# Altium schematic sheet 01 ZYNQ_DDR.SchDoc
size A4
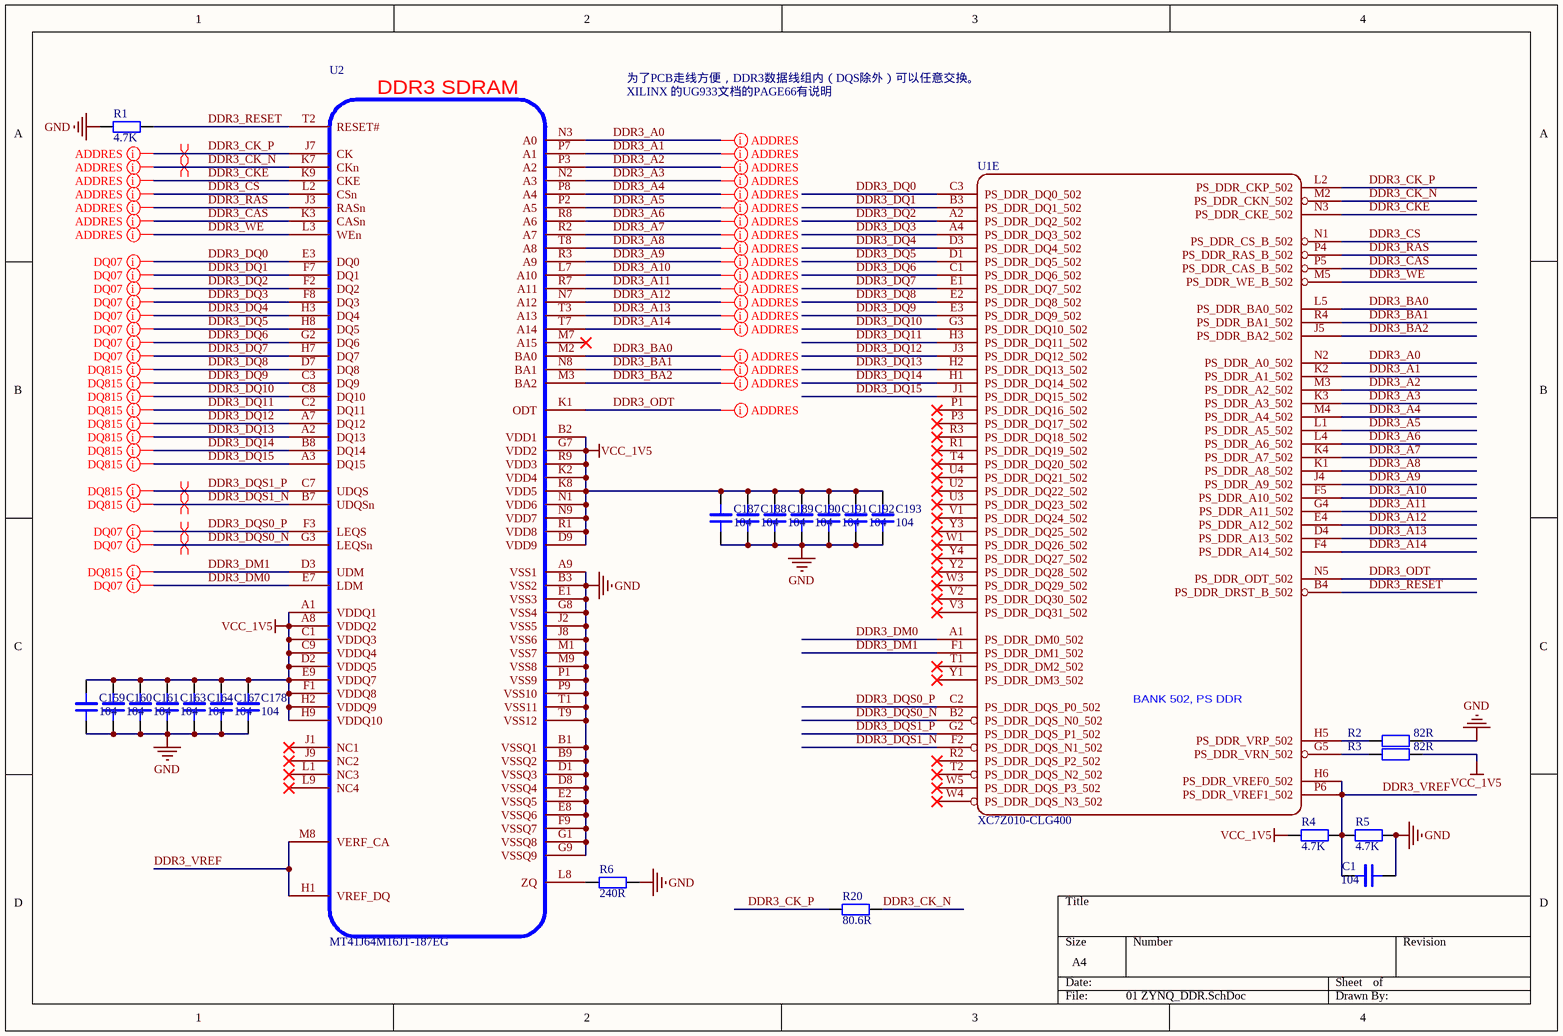
[diagram p0: 01 ZYNQ_DDR.SchDoc]

## Parts
C1  104  [LC-0402_C]
C159  104  [LC-0402_C]
C160  104  [LC-0402_C]
C161  104  [LC-0402_C]
C163  104  [LC-0402_C]
C164  104  [LC-0402_C]
C167  104  [LC-0402_C]
C178  104  [LC-0402_C]
C187  104  [LC-0402_C]
C188  104  [LC-0402_C]
C189  104  [LC-0402_C]
C190  104  [LC-0402_C]
C191  104  [LC-0402_C]
C192  104  [LC-0402_C]
C193  104  [LC-0402_C]
R1  4.7K  [LC-0402_R]
R2  82R  [LC-0402_R]
R3  82R  [LC-0402_R]
R4  4.7K  [LC-0402_R]
R5  4.7K  [LC-0402_R]
R6  240R  [LC-0402_R]
R20  80.6R  [LC-0402_R]
U1  XC7Z010-CLG400  [CLG400-0.8]  (part E of 8)
U2  MT41J64M16JT-187EG  [FBGA96]

## Nets
GND: C1.2 C159.1 C160.1 C161.1 C163.1 C164.1 C167.1 C178.1 C187.1 C188.1 C189.1 C190.1 C191.1 C192.1 C193.1 R1.2 R2.1 R5.1 R6.2 U2.A9(VSS1) U2.B1(VSSQ1) U2.B3(VSS2) U2.B9(VSSQ2) U2.D1(VSSQ3) U2.D8(VSSQ4) U2.E1(VSS3) U2.E2(VSSQ5) U2.E8(VSSQ6) U2.F9(VSSQ7) U2.G1(VSSQ8) U2.G8(VSS4) U2.G9(VSSQ9) U2.J2(VSS5) U2.J8(VSS6) U2.M1(VSS7) U2.M9(VSS8) U2.P1(VSS9) U2.P9(VSS10) U2.T1(VSS11) U2.T9(VSS12)
VCC_1V5: C159.2 C160.2 C161.2 C163.2 C164.2 C167.2 C178.2 C187.2 C188.2 C189.2 C190.2 C191.2 C192.2 C193.2 R3.1 R4.2 U2.A1(VDDQ1) U2.A8(VDDQ2) U2.B2(VDD1) U2.C1(VDDQ3) U2.C9(VDDQ4) U2.D2(VDDQ5) U2.D9(VDD9) U2.E9(VDDQ7) U2.F1(VDDQ8) U2.G7(VDD2) U2.H2(VDDQ9) U2.H9(VDDQ10) U2.K2(VDD4) U2.K8(VDD5) U2.N1(VDD6) U2.N9(VDD7) U2.R1(VDD8) U2.R9(VDD3)
DDR3_A0: U1.N2(PS_DDR_A0_502) U2.N3(A0)
DDR3_A1: U1.K2(PS_DDR_A1_502) U2.P7(A1)
DDR3_A2: U1.M3(PS_DDR_A2_502) U2.P3(A2)
DDR3_A3: U1.K3(PS_DDR_A3_502) U2.N2(A3)
DDR3_A4: U1.M4(PS_DDR_A4_502) U2.P8(A4)
DDR3_A5: U1.L1(PS_DDR_A5_502) U2.P2(A5)
DDR3_A6: U1.L4(PS_DDR_A6_502) U2.R8(A6)
DDR3_A7: U1.K4(PS_DDR_A7_502) U2.R2(A7)
DDR3_A8: U1.K1(PS_DDR_A8_502) U2.T8(A8)
DDR3_A9: U1.J4(PS_DDR_A9_502) U2.R3(A9)
DDR3_A10: U1.F5(PS_DDR_A10_502) U2.L7(A10)
DDR3_A11: U1.G4(PS_DDR_A11_502) U2.R7(A11)
DDR3_A12: U1.E4(PS_DDR_A12_502) U2.N7(A12)
DDR3_A13: U1.D4(PS_DDR_A13_502) U2.T3(A13)
DDR3_A14: U1.F4(PS_DDR_A14_502) U2.T7(A14)
DDR3_BA0: U1.L5(PS_DDR_BA0_502) U2.M2(BA0)
DDR3_BA1: U1.R4(PS_DDR_BA1_502) U2.N8(BA1)
DDR3_BA2: U1.J5(PS_DDR_BA2_502) U2.M3(BA2)
DDR3_CAS: U1.P5(PS_DDR_CAS_B_502) U2.K3(CASn)
DDR3_CK_N: R20.2 U1.M2(PS_DDR_CKN_502) U2.K7(CKn)
DDR3_CK_P: R20.1 U1.L2(PS_DDR_CKP_502) U2.J7(CK)
DDR3_CKE: U1.N3(PS_DDR_CKE_502) U2.K9(CKE)
DDR3_CS: U1.N1(PS_DDR_CS_B_502) U2.L2(CSn)
DDR3_DM0: U1.A1(PS_DDR_DM0_502) U2.E7(LDM)
DDR3_DM1: U1.F1(PS_DDR_DM1_502) U2.D3(UDM)
DDR3_DQ0: U1.C3(PS_DDR_DQ0_502) U2.E3(DQ0)
DDR3_DQ1: U1.B3(PS_DDR_DQ1_502) U2.F7(DQ1)
DDR3_DQ2: U1.A2(PS_DDR_DQ2_502) U2.F2(DQ2)
DDR3_DQ3: U1.A4(PS_DDR_DQ3_502) U2.F8(DQ3)
DDR3_DQ4: U1.D3(PS_DDR_DQ4_502) U2.H3(DQ4)
DDR3_DQ5: U1.D1(PS_DDR_DQ5_502) U2.H8(DQ5)
DDR3_DQ6: U1.C1(PS_DDR_DQ6_502) U2.G2(DQ6)
DDR3_DQ7: U1.E1(PS_DDR_DQ7_502) U2.H7(DQ7)
DDR3_DQ8: U1.E2(PS_DDR_DQ8_502) U2.D7(DQ8)
DDR3_DQ9: U1.E3(PS_DDR_DQ9_502) U2.C3(DQ9)
DDR3_DQ10: U1.G3(PS_DDR_DQ10_502) U2.C8(DQ10)
DDR3_DQ11: U1.H3(PS_DDR_DQ11_502) U2.C2(DQ11)
DDR3_DQ12: U1.J3(PS_DDR_DQ12_502) U2.A7(DQ12)
DDR3_DQ13: U1.H2(PS_DDR_DQ13_502) U2.A2(DQ13)
DDR3_DQ14: U1.H1(PS_DDR_DQ14_502) U2.B8(DQ14)
DDR3_DQ15: U1.J1(PS_DDR_DQ15_502) U2.A3(DQ15)
DDR3_DQS0_N: U1.B2(PS_DDR_DQS_N0_502) U2.G3(LEQSn)
DDR3_DQS0_P: U1.C2(PS_DDR_DQS_P0_502) U2.F3(LEQS)
DDR3_DQS1_N: U1.F2(PS_DDR_DQS_N1_502) U2.B7(UDQSn)
DDR3_DQS1_P: U1.G2(PS_DDR_DQS_P1_502) U2.C7(UDQS)
DDR3_ODT: U1.N5(PS_DDR_ODT_502) U2.K1(ODT)
DDR3_RAS: U1.P4(PS_DDR_RAS_B_502) U2.J3(RASn)
DDR3_RESET: R1.1 U1.B4(PS_DDR_DRST_B_502) U2.T2(RESET#)
DDR3_VREF: C1.1 R4.1 R5.2 U1.H6(PS_DDR_VREF0_502) U1.P6(PS_DDR_VREF1_502) U2.H1(VREF_DQ) U2.M8(VERF_CA)
DDR3_WE: U1.M5(PS_DDR_WE_B_502) U2.L3(WEn)
NetR2_2: R2.2 U1.H5(PS_DDR_VRP_502)
NetR3_2: R3.2 U1.G5(PS_DDR_VRN_502)
NetR6_1: R6.1 U2.L8(ZQ)

Not connected (* = marked no-connect by the designer): U1 P1(PS_DDR_DQ16_502)* P3(PS_DDR_DQ17_502)* R1(PS_DDR_DQ19_502)* R2(PS_DDR_DQS_P2_502)* R3(PS_DDR_DQ18_502)* T1(PS_DDR_DM2_502)* T2(PS_DDR_DQS_N2_502)* T4(PS_DDR_DQ20_502)* U2(PS_DDR_DQ22_502)* U3(PS_DDR_DQ23_502)* U4(PS_DDR_DQ21_502)* V1(PS_DDR_DQ24_502)* V2(PS_DDR_DQ30_502)* V3(PS_DDR_DQ31_502)* W1(PS_DDR_DQ26_502)* W3(PS_DDR_DQ29_502)* W4(PS_DDR_DQS_N3_502)* W5(PS_DDR_DQS_P3_502)* Y1(PS_DDR_DM3_502)* Y2(PS_DDR_DQ28_502)* Y3(PS_DDR_DQ25_502)* Y4(PS_DDR_DQ27_502)*; U2 J1(NC1)* J9(NC2)* L1(NC3)* L9(NC4)* M7(A15)*

## Layout directives
net class ADDRES: DDR3_A0, DDR3_A1, DDR3_A2, DDR3_A3, DDR3_A4, DDR3_A5, DDR3_A6, DDR3_A7, DDR3_A8, DDR3_A9, DDR3_A10, DDR3_A11, DDR3_A12, DDR3_A13, DDR3_A14, DDR3_BA0, DDR3_BA1, DDR3_BA2, DDR3_CAS, DDR3_CK_N, DDR3_CK_P, DDR3_CKE, DDR3_CS, DDR3_ODT, DDR3_RAS, DDR3_WE
net class DQ07: DDR3_DM0, DDR3_DQ0, DDR3_DQ1, DDR3_DQ2, DDR3_DQ3, DDR3_DQ4, DDR3_DQ5, DDR3_DQ6, DDR3_DQ7, DDR3_DQS0_N, DDR3_DQS0_P
net class DQ815: DDR3_DM1, DDR3_DQ8, DDR3_DQ9, DDR3_DQ10, DDR3_DQ11, DDR3_DQ12, DDR3_DQ13, DDR3_DQ14, DDR3_DQ15, DDR3_DQS1_N, DDR3_DQS1_P
differential pair: DDR3_CK_N, DDR3_CK_P, DDR3_DQS0_N, DDR3_DQS0_P, DDR3_DQS1_N, DDR3_DQS1_P

## Notes on the sheet
- 为了PCB走线方便，DDR3数据线组内（DQS除外）可以任意交换。
- XILINX 的UG933文档的PAGE66有说明
- (in symbol DDR3) DDR3 SDRAM
- (in symbol XC7Z010-CLG400, part E) BANK 502, PS DDR

## Library data of the parts
C1 C159-C161 C163 C164 C167 C178 C187-C193 = CAP: Capacitor
R1-R6 R20 = RES: Resistor
U2 = DDR3